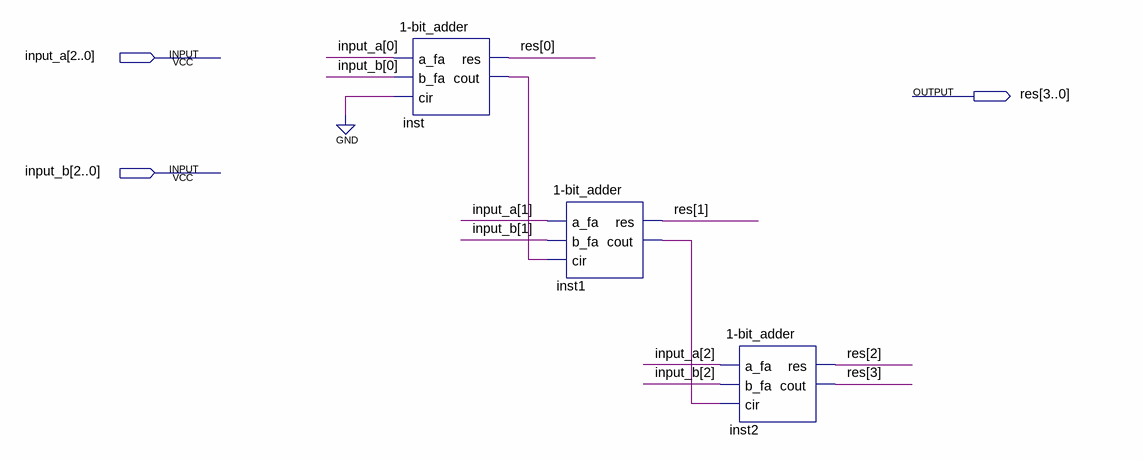
[diagram p0: schematic sheet]
// Quartus schematic 3-bit_adder.bdf as structural Verilog: 3 symbols, 3 pins
module \3-bit_adder  (
  input  [2:0] input_a,
  input  [2:0] input_b,
  output [3:0] res
);

  wire inst1_cout, inst_cout;

  \1-bit_adder  inst (.a_fa(input_a[0]), .b_fa(input_b[0]), .cir(1'b0), .res(res[0]), .cout(inst_cout));
  \1-bit_adder  inst1 (.a_fa(input_a[1]), .b_fa(input_b[1]), .cir(inst_cout), .res(res[1]), .cout(inst1_cout));
  \1-bit_adder  inst2 (.a_fa(input_a[2]), .b_fa(input_b[2]), .cir(inst1_cout), .res(res[2]), .cout(res[3]));
endmodule
